# EAGLE design GDEnvSensorGW_1_13 (EAGLE 8.2.1)
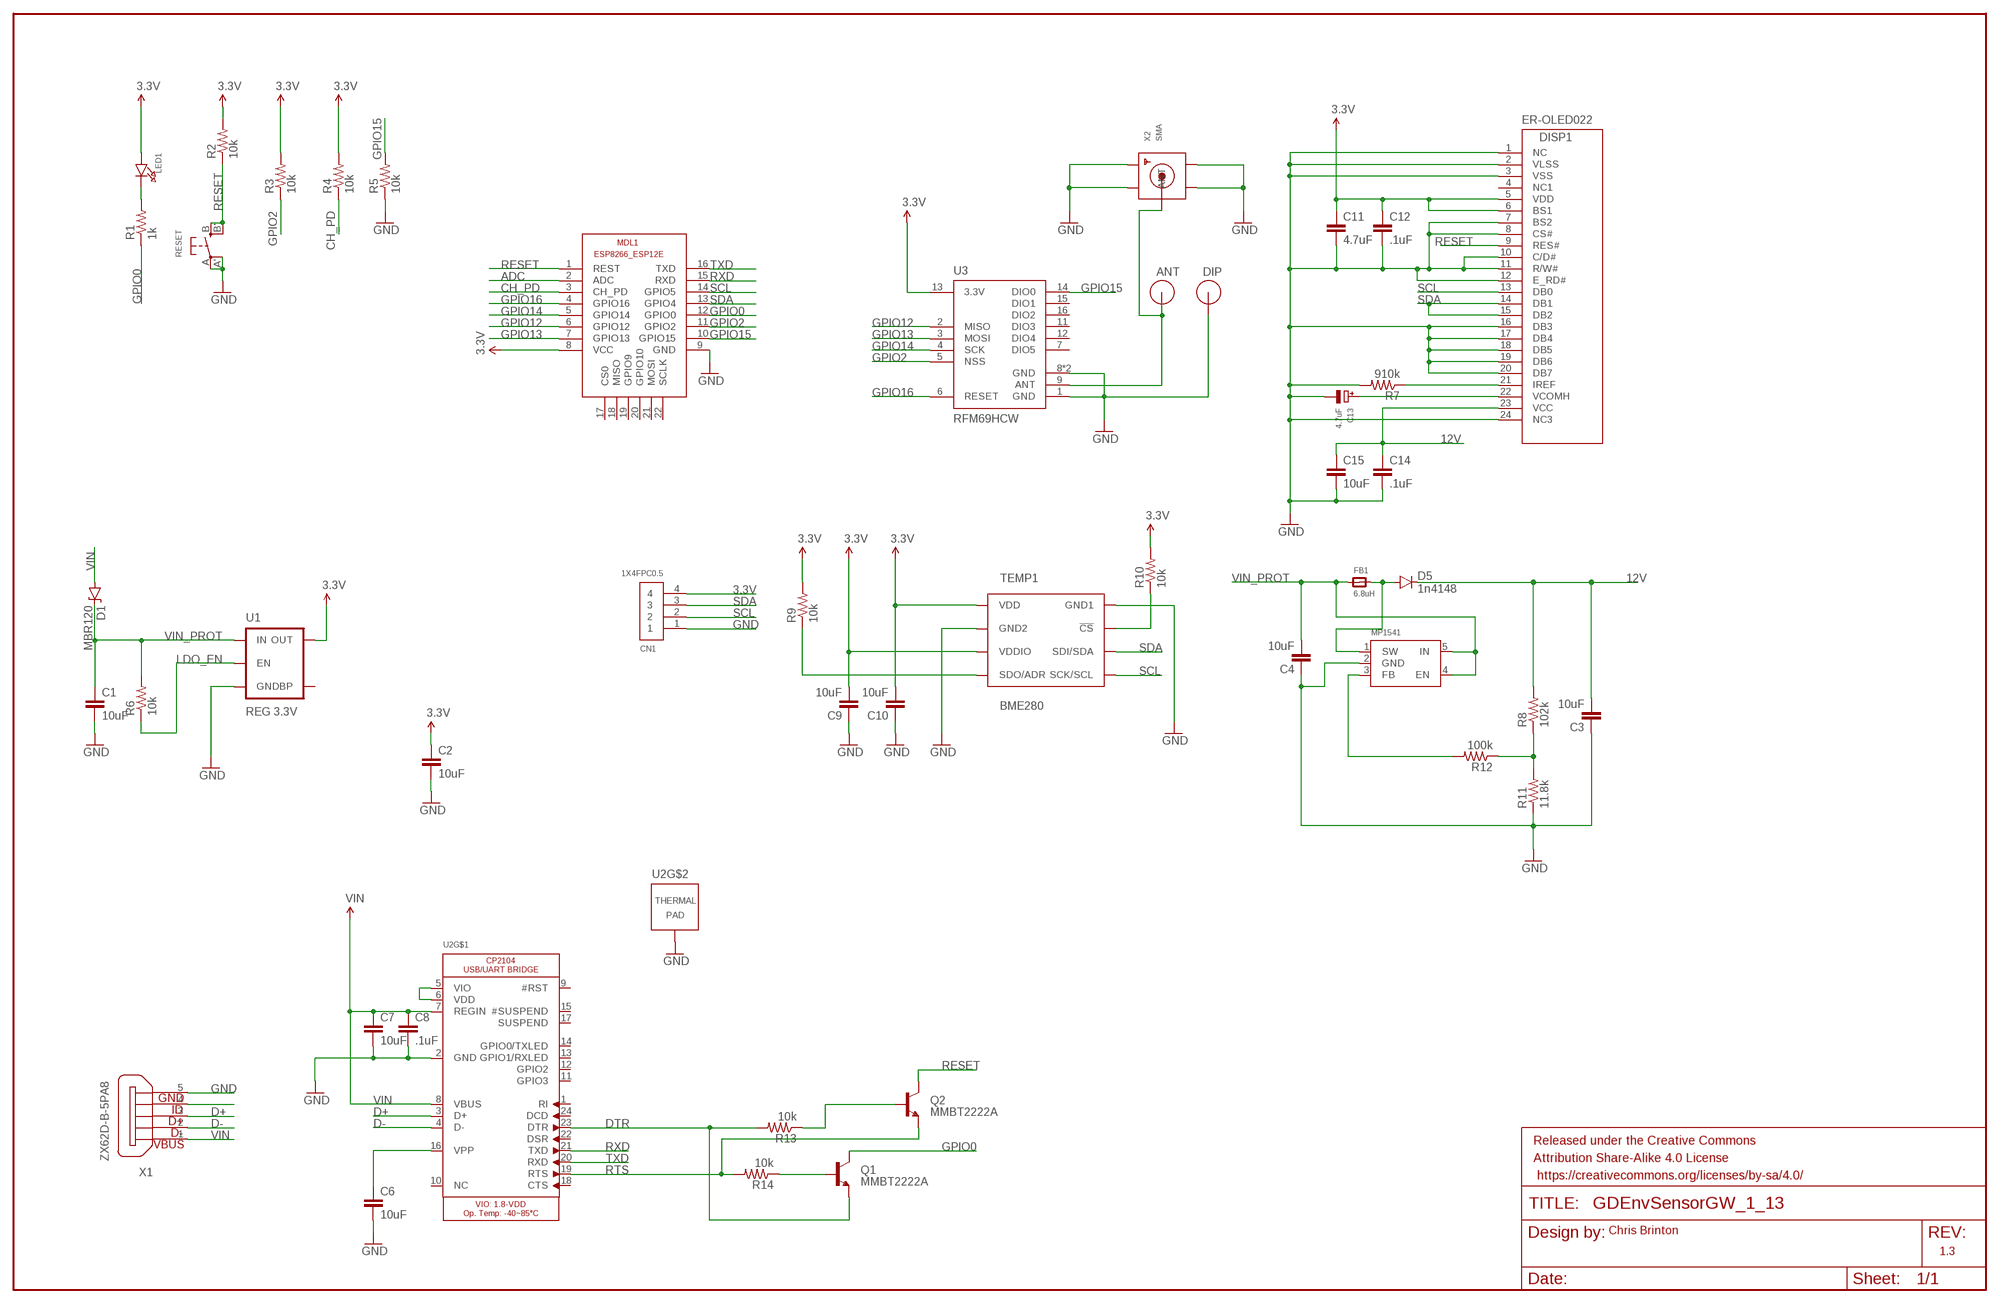
[diagram p0: schematic, sheet 1]

## Parts
ANT  RFM12B_ANTENNA  [RFM12B-ANTENNA]
ANT1  RFM12B_ANTENNA  [RFM12B-ANTENNA]
C1  10uF  10UF10V10%(0805)  [0805-CAP]
C2  10uF  10UF10V10%(0805)  [0805-CAP]
C3  10uF  10UF10V10%(0805)  [0805-CAP]
C4  10uF  10UF10V10%(0805)  [0805-CAP]
C6  10uF  10UF10V10%(0805)  [0805-CAP]
C7  10uF  10UF10V10%(0805)  [0805-CAP]
C8  .1uF  10UF10V10%(0805)  [0805-CAP]
C9  10uF  10UF10V10%(0805)  [0805-CAP]
C10  10uF  10UF10V10%(0805)  [0805-CAP]
C11  4.7uF  10UF10V10%(0805)  [0805-CAP]
C12  .1uF  10UF10V10%(0805)  [0805-CAP]
C13  4.7uF  CAP_TANTALUMA/3216_REFLOW  [EIA3216-18/A-R]
C14  .1uF  10UF10V10%(0805)  [0805-CAP]
C15  10uF  10UF10V10%(0805)  [0805-CAP]
CN1  1X4FPC0.5  [FPC_0.5MM-4]
D1  MBR120  DIODE-ZENER16V  [SOD-123]
D5  1n4148  DIODEBAS16  [SOD-323]
DISP1  ER-OLED022  [ER-OLED022]
FB1  6.8uH  FERRITE_0805  [_0805]
FRAME1  FRAME-LEDGER  [CREATIVE_COMMONS]
LED1  LED0805  [CHIPLED_0805]
MDL1  ESP8266-ESP12F  ESP8266-12EESP8266-ESP12E  [ESP8266-ESP12E]
MP1541  MP1541_SOT23-5  [SOT23-5]
Q1  MMBT2222A  TRANSISTOR_NPNMMBT2222A  [SOT23-3]
Q2  MMBT2222A  TRANSISTOR_NPNMMBT2222A  [SOT23-3]
R1  1k  R-US_R0805  [R0805]
R2  10k  R-US_R0805  [R0805]
R3  10k  R-US_R0805  [R0805]
R4  10k  R-US_R0805  [R0805]
R5  10k  R-US_R0805  [R0805]
R6  10k  R-US_R0805  [R0805]
R7  910k  R-US_R0805  [R0805]
R8  102k  R-US_R0805  [R0805]
R9  10k  R-US_R0805  [R0805]
R10  10k  R-US_R0805  [R0805]
R11  11.8k  R-US_R0805  [R0805]
R12  100k  R-US_R0805  [R0805]
R13  10k  R-US_R0805  [R0805]
R14  10k  R-US_R0805  [R0805]
RESET  SWITCH_TACT_SMT4.6X2.8  [BTN_KMR2_4.6X2.8]
TEMP1  BME280  [BME280_LGA]
U1  REG 3.3V  V_REG_MIC52193.3V  [SOT23-5]
U2  CP2104  [QFN24_4MM_SMSC]
U3  RFM69HCW  [RFM69HCW-XXXS2]
X1  ZX62D-B-5PA8  [ZX62D-B-5PA8]
X2  SMA  SMACONNECTOR_EDGE_UFL  [SMA_EDGELAUNCH_UFL]

## Nets
3.3V: C2.1 C9.2 C10.2 C11.1 C12.1 CN1.4 DISP1.5(VDD) DISP1.6(BS1) LED1.A MDL1.8(VCC) R2.2 R3.2 R4.2 R9.2 R10.2 TEMP1.P$6(VDDIO) TEMP1.P$8(VDD) U1.5(OUT) U3.13(3.3V)
12V: C3.2 C14.1 C15.1 D5.C DISP1.23(VCC) R8.2
ADC: MDL1.2(ADC)
ANT: ANT.P$1 U3.9(ANT) X2.P(ANT)
CH_PD: MDL1.3(CH_PD) R4.1
D+: U2.3(D+) X1.3
D-: U2.4(D-) X1.2
DTR: Q1.2(E) R13.2 U2.23(DTR)
GND: ANT1.P$1 C1.2 C2.2 C3.1 C4.1 C6.2 C7.2 C8.2 C9.1 C10.1 C11.2 C12.2 C13.- C14.2 C15.2 CN1.1 DISP1.1(NC) DISP1.2(VLSS) DISP1.3(VSS) DISP1.7(BS2) DISP1.8(CS#) DISP1.10(C/D#) DISP1.11(R/W#) DISP1.12(E_RD#) DISP1.16(DB3) DISP1.17(DB4) DISP1.18(DB5) DISP1.19(DB6) DISP1.20(DB7) DISP1.24(NC3) MDL1.9(GND) MP1541.2(GND) R5.1 R7.2 R11.1 RESET.A'(P1) RESET.A(P) TEMP1.P$1(GND1) TEMP1.P$7(GND2) U1.2(GND) U2.2(GND) U2.THERM(TP) U3.1(GND) U3.8(GND) U3.10(GND) X1.5 X2.GND@1(GND1) X2.GND@2(GND2) X2.GND@3(GND3) X2.GND@4(GND4)
GPIO0: MDL1.12(GPIO0) Q1.3(C) R1.1
GPIO2: MDL1.11(GPIO2) R3.1 U3.5(NSS)
GPIO12: MDL1.6(GPIO12) U3.2(MISO)
GPIO13: MDL1.7(GPIO13) U3.3(MOSI)
GPIO14: MDL1.5(GPIO14) U3.4(SCK)
GPIO15: MDL1.10(GPIO15) R5.2 U3.14(DIO0)
GPIO16: MDL1.4(GPIO16) U3.6(RESET)
LDO_EN: R6.1 U1.3(EN)
N$1: U2.5(VIO) U2.6(VDD)
N$3: LED1.C R1.2
N$4: C13.+ DISP1.22(VCOMH)
N$5: C6.1 U2.16(VPP)
N$6: R10.1 TEMP1.P$2(!CS)
N$8: D5.A FB1.2 MP1541.1(SW)
N$9: Q2.1(B) R13.1
N$10: R8.1 R11.2 R12.1
N$11: DISP1.21(IREF) R7.1
N$15: MP1541.3(FB) R12.2
N$16: X1.4
N$17: Q1.1(B) R14.1
RESET: DISP1.9(RES#) MDL1.1(REST) Q2.3(C) R2.1 RESET.B'(S1) RESET.B(S)
RTS: Q2.2(E) R14.2 U2.19(RTS)
RXD: MDL1.15(RXD) U2.21(TXD)
SCL: CN1.2 DISP1.13(DB0) MDL1.14(GPIO5) TEMP1.P$4(SCK/SCL)
SDA: CN1.3 DISP1.14(DB1) DISP1.15(DB2) MDL1.13(GPIO4) TEMP1.P$3(SDI/SDA)
SDO: R9.1 TEMP1.P$5(SDO/ADR)
TXD: MDL1.16(TXD) U2.20(RXD)
VIN: C7.1 C8.1 D1.A U2.7(REGIN) U2.8(VBUS) X1.1
VIN_PROT: C1.1 C4.2 D1.C FB1.1 MP1541.4(EN) MP1541.5(IN) R6.2 U1.1(IN)
Unconnected: DISP1.4(NC1) MDL1.17(CS0) MDL1.18(MISO) MDL1.19(GPIO9) MDL1.20(GPIO10) MDL1.21(MOSI) MDL1.22(SCLK) U1.4(BP) U2.1(RI) U2.9(#RST) U2.10(NC) U2.11(GPIO3) U2.12(GPIO2) U2.13(GPIO1/RXLED) U2.14(GPIO0/TXLED) U2.15(#SUSPEND) U2.17(SUSPEND) U2.18(CTS) U2.22(DSR) U2.24(DCD) U3.7(DIO5) U3.11(DIO3) U3.12(DIO4) U3.15(DIO1) U3.16(DIO2) X1.S1 X1.S2 X1.S3 X1.S4

## Notes on the sheet
- Chris Brinton
- 1.3

## Library data of the parts
ANT = LowPowerLab:RFM12B_ANTENNA; LABEL: ANT
ANT1 = LowPowerLab:RFM12B_ANTENNA; LABEL: DIP
C1-C4 C6-C12 C14 C15 = SparkFun-Capacitors:10UF10V10%(0805): CAP-11330; PROD_ID: CAP-11330
C13 = microbuilder:CAP_TANTALUM: Tantalum Capacitors Wave footprints have larger pads and are meant to be used for hand soldering. Reflow footprints are optimised for solder paste and a reflow oven. EIA3216-18/A-[R/W] - Size A / 3216-18 / 1206 footprint 4.7µF 25V 10% Tantalum Capacitor 10µF 16V 10% Tantalum Capacitor [Digikey: 495-2236-2-ND] EIA3528-21/B-[R/W] - Size B / 3528-21 47µF 10V 10% Tantalum Capactior [Digikey: 495-2216-1-ND] EIA6032-28/C-[R/W] - Size C / 6032-28 10µF 35V 20% Tantalum Capacitor [Digikey: 495-2285-1-ND] 100µF 16V 10% Tantalum Capactior [Digikey: 399-5214-1-ND]
CN1 = adafruit:1X4: 4-pin connector
D1 = SparkFun-DiscreteSemi:DIODE-ZENER: Zener Diode Production Part - 8199 3.4V Zener Voltage; PROD_ID: DIO-12440; VALUE: 16V
D5 = SparkFun-DiscreteSemi:DIODE: Diode These are standard reverse protection diodes and small signal diodes. SMA package can handle up to about 1A. SOD-323 can handle about 200mA. What the SOD-323 package when ordering, there are some mfgs out there that are 5-pin packages.; PROD_ID: DIO-09646; VALUE: 250mA/100V
DISP1 = GDTech:ER-OLED022: East Rising 2.2" OLED display 128x32 24 pin .5mm pitch FPC connector
FB1 = microbuilder:FERRITE: Ferrite Bead 0603 MMZ1608B121C - 120 Ohm @ 100MHz, 600mA, 0.15 Ohm DC Resistance - Digikey: 445-2164-1-ND BK1608HW121-T - 120 Ohm, 600mA Ferrite Chip - Digikey: 587-1876-2-ND 0805 HZ0805B272R-10 - 2.7K Ohm @ 100MHz, 200mA, 0.8 Ohm DC Resistance - Digikey: 240-2504-1-ND (see also Murata BLM21BD272SN1L) MMZ2012Y152B - 1.5K Ohm @ 100MHz, 500mA, 0.4 Ohm DC Resistance - Digikey: 445-1560-1-ND - Mainly for high frequency (80-400MHz) MMZ2012R102A - 1K Ohm @ 100MHz, 500mA, 0.3 Ohm DC Resistance - Digikey: 445-1555-2-ND - More general purpose (10-200MHz)
FRAME1 = SparkFun-Aesthetics:FRAME-LEDGER: Schematic Frame Standard 11x14 US Ledger frame
LED1 = microbuilder:LED: LED 0603 - 0603 Surface Mount Package 2mA: Green LED - Low Power (3.9mcd, 2ma, 1.7Vf) - Digikey: 475-2709-2-ND Orange LED - Low Power (9.8mcd, 2ma, 1.8Vf) - Digikey: 475-1194-2-ND Red LED - Low Power (5mcd, 2ma, 1.8Vf) - Digikey: 475-1195-2-ND Yellow LED - Low Power (7mcd, 2ma, 1.8Vf) - Digikey: 475-1196-2-ND 5mA: Blue LED - Low Power (17mcd, 5ma, 2.9Vf) - Digikey: LNJ937W8CRACT-ND 0805 - 0805 Surface Mount Package 2mA: Red LED (8.8mcd, 2mA, 1.8Vf, Clear) - Low Power [Digikey: 475-2510-1-ND] Green LED (5mcd, 2mA, 1.8Vf, Clear) - Low Power [Digikey: 475-2730-1-ND] Yellow LED (11.3mcd, 2mA, 1.8Vf, Clear) - Low Power [Digikey: 475-2555-1-ND] 20mA: Red LED (104mcd, 20mA, Diffused) - LS R976 [Digikey: 475-1278-6-ND] Red LED (12mcd, 20mA, 2.0Vf, Clear) - APT2012EC [Digikey: 754-1128-1-ND] Green LED (15mcd, 20mA, 2.2Vf, Clear) - APT2012GC [Digikey: 754-1131-1-ND] Orange LED (160mcd, 20mA, 2.1Vf, Clear) - APT2012SECK [Digikey: 754-1130-1-ND] 1206 - 1206 Surface Mount Package Green LED (26mcd, 20mA, Diffused) - LG N971 [Digikey: 475-1407-6-ND] Red LED (15mcd, 20mA, Diffused) - LH N974 [Digikey: 475-1416-6-ND]
MDL1 = ESP12E:ESP8266-12E: ESP8266-12E with additional I/O and GPIO04/05 corrected The author cannot warrant that this library is free from error or will meet your specific requirements. Created by PuceBaboon.com. Komagane, Nagano, JAPAN
MP1541 = GDTech:MP1541_SOT23-5: SOT23-5 MP1541 Voltage Boost The MP1541 is a 5-pin thin SOT23 current mode step up converter intended for small, low power applications
Q1 Q2 = SparkFun-DiscreteSemi:TRANSISTOR_NPN: Generic NPN BJT MMBT2222A - TRANS-08049 (SOT-23, 1A 40V) MPSA42 - TRANS-09116 (SOT-23, 500mA 300V) MMBT5088LT1G - TRANS-11160 (SOT-23, 50 mA 30V) BC547 - COM-08928 <http://www.sparkfun.com/products/8928> (TO-92 45V 100mA) (1.Collector 2.Base 3.Emitter) 2N3904 - COM-00521 <http://www.sparkfun.com/products/521> (TO-92 40V 200mA) (1.Emitter 2.Base 3.Collector) P2N2222A - COM-12852 <http://www.sparkfun.com/products/12852> (TO-92 40V 600mA) (1.Collector 2.Base 3.Emitter); PROD_ID: TRANS-08049
R1-R14 = adafruit:R-US_: RESISTOR, American symbol
RESET = microbuilder:SWITCH_TACT_SMT: SMT Tact Switches 6x6mm - Digikey: P12940SCT-ND KMR2 (4.6x2.8mm) - Digikey: 401-1426-1-ND EVQ-PQHB55 - Light Touch, 160GF (4.5x4.5mm) - Digikey: P8090SCT-ND
TEMP1 = BME280ComponentLibrary:BME280; PROD_ID: IC-13090
U1 = SparkFun-PowerIC:V_REG_MIC5219: V_REG MIC5219 Standard 3.3V and 5V 500mA LDO voltage regulator in SOT-23 layout. Micrel part MIC5219. BP (by-pass) pin is used to lower output noise with 470pF cap, may be left open.; PROD_ID: VREG-09872; VALUE: MIC5219 3.3V
U2 = GDTech:CP2104: CP2104 - USB to UART Bridge VDD Output: 3.45V
U3 = SparkFun-RF:RFM69H; PROD_ID: IC-11997, IC-12053
X1 = GDTech:ZX62D-B-5PA8: Micro USB Type B Connector - Standard, Shell Through Hole Source: http://www.hirose.co.jp/cataloge_hp/ed_ZX_20140804.pdf; MF: Hirose; MPN: ZX62D-B-5PA8; OC_FARNELL: 2300438; OC_NEWARK: 69W0712
X2 = adafruit:SMACONNECTOR: SMA Connector 90° DIP SMA Connector, 50 Ohm (4UConnector: 07259)

## Board
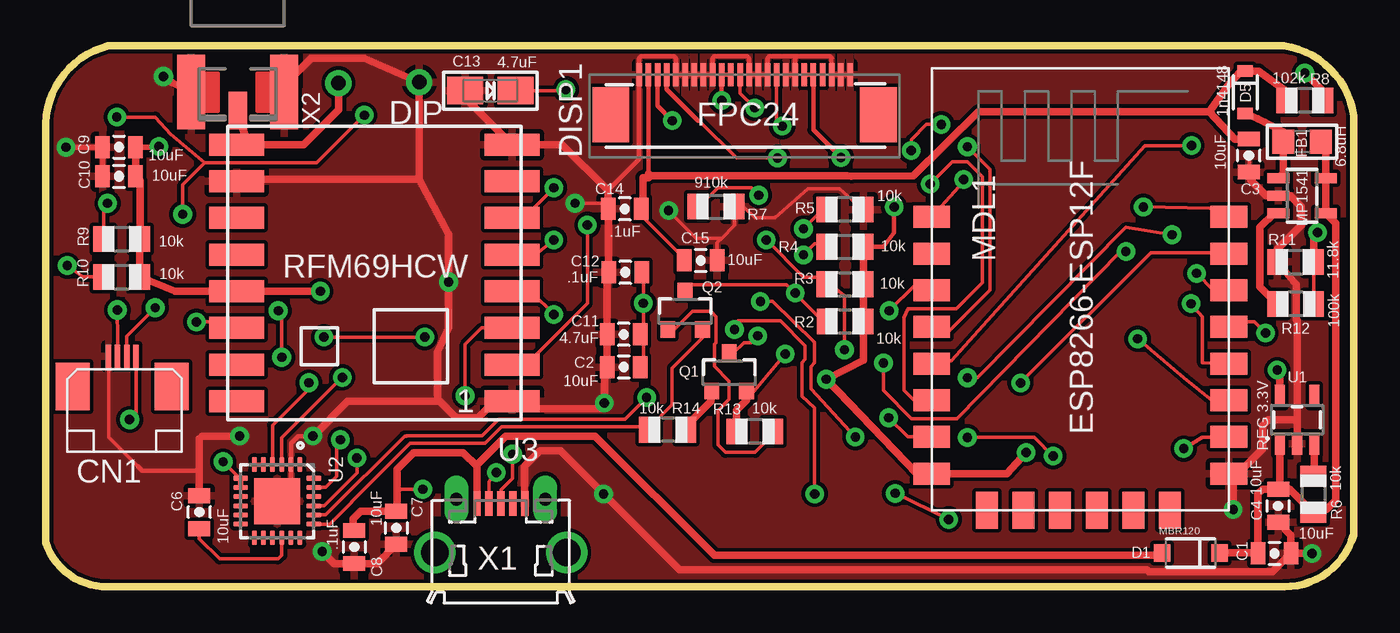
[diagram p1: board, top side]
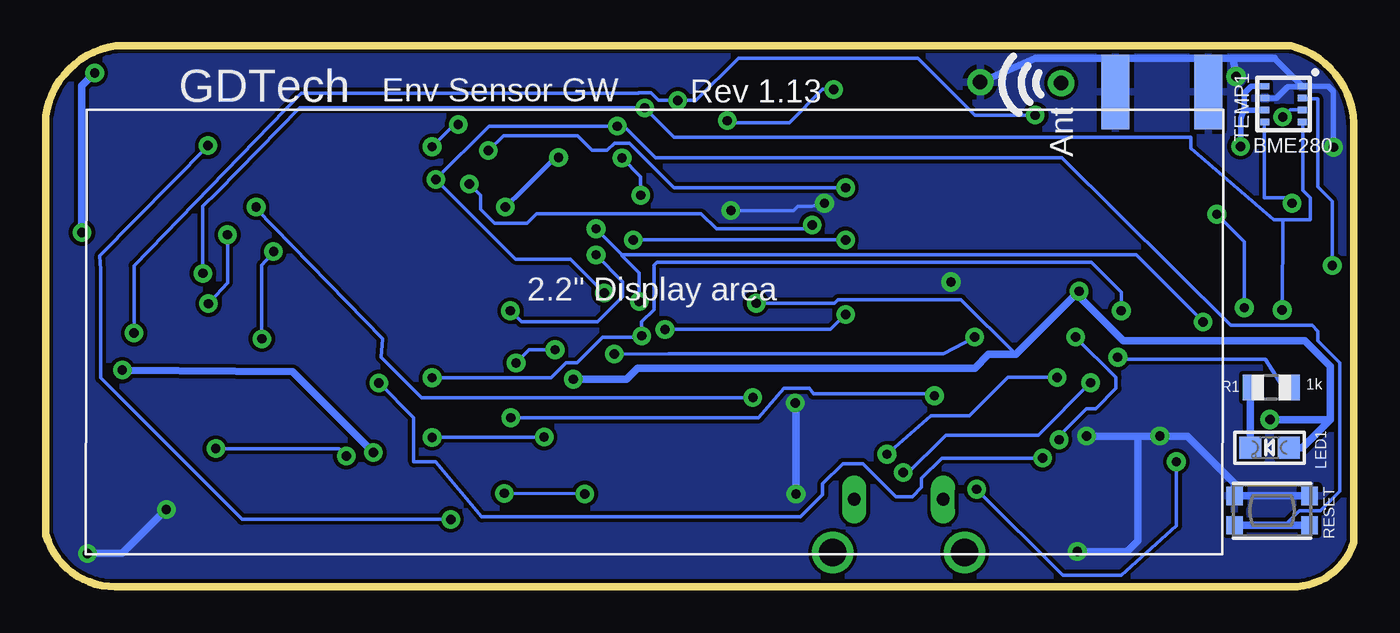
[diagram p2: board, bottom side, seen from below]

Size 71.34 x 29.49 mm. Coordinates in mm from the lower left corner, seen from the top.
Outline: 0,25.28 arc-74 3.41,29.49 67.53,29.49 arc-74 71.34,25.68 71.34,2.82 arc-74 67.56,0 3.39,0 arc-74 0,2.42 0,25.28
Copper layers (1*16): Top 0.035mm / dielectric 1.5mm / Bottom 0.035mm
Design rules "SparkFun": minimum track width 8mil, minimum drill 20mil, track to track 8mil, track to pad 8mil, pad to pad 8mil, via to via 8mil, smd to smd 8mil, copper to edge 8mil, drill to drill 8mil, minimum pad ring 12mil, minimum via ring 10mil, stop-mask expansion 4mil, vias tented up to drill 20mil, thermal gap 10mil

### Footprints (pad centres in the part's own frame; a part is rotated, then mirrored left to right if it is on the bottom)
RFM12B-ANTENNA = drill 0.8 pad 1.422: P$1 0,0
0805-CAP = smd 0.8 x 1.2: 1 -0.9,0; 2 0.9,0
EIA3216-18/A-R = smd 1.95 x 1.5: + 1.375,0; - -1.375,0
FPC_0.5MM-4 = smd 0.3 x 1.25: 1 -0.75,-0.45; 2 -0.25,-0.45; 3 0.25,-0.45; 4 0.75,-0.45 | smd 1.85 x 2.6: MT -2.7,-2.1; MT2 2.7,-2.1
SOD-123 = smd 0.9 x 0.95: A 1.575,0; C -1.575,0
SOD-323 = smd 0.63 x 0.83: A 1.15,0; C -1.15,0
ER-OLED022 = smd 0.3 x 1.25: 1 5.75,12.905; 2 5.25,12.905; 3 4.75,12.905; 4 4.25,12.905; 5 3.75,12.905; 6 3.25,12.905; 7 2.75,12.905; 8 2.25,12.905; 9 1.75,12.905; 10 1.25,12.905; 11 0.75,12.905; 12 0.25,12.905; 13 -0.25,12.905; 14 -0.75,12.905; 15 -1.25,12.905; 16 -1.75,12.905; 17 -2.25,12.905; 18 -2.75,12.905; 19 -3.25,12.905; 20 -3.75,12.905; 21 -4.25,12.905; 22 -4.75,12.905; 23 -5.25,12.905; 24 -5.75,12.905 | smd 2 x 3: MOUNT1 -7.3,10.705; MOUNT2 7.3,10.705
_0805 = smd 1.2 x 1.3: 1 -1.016,0; 2 1.016,0
CHIPLED_0805 = smd 1.2 x 1.2: A 0,-1.05; C 0,1.05
ESP8266-ESP12E = smd 2 x 1.2: 1 0,16; 2 0,14; 3 0,12; 4 0,10; 5 0,8; 6 0,6; 7 0,4; 8 0,2; 9 16.2,2; 10 16.2,4; 11 16.2,6; 12 16.2,8; 13 16.2,10; 14 16.2,12; 15 16.2,14; 16 16.2,16 | smd 1.2 x 2: 17 11,0; 18 3,0; 19 5,0; 20 13,0; 21 7,0; 22 9,0
SOT23-5 = smd 0.55 x 1.2: 1 -0.95,-1.3; 2 0,-1.3; 3 0.95,-1.3; 4 0.95,1.3; 5 -0.95,1.3
SOT23-3 = smd 0.8 x 0.9: 1 -0.95,-1; 2 0.95,-1; 3 0,1.1
R0805 = smd 1.1 x 1.4: 1 -1,0; 2 1,0
BTN_KMR2_4.6X2.8 = smd 0.9 x 1: A 2.05,0.8; A' -2.05,0.8; B 2.05,-0.8; B' -2.05,-0.8
BME280_LGA = smd 0.5 x 0.35: P$1 1.025,0.975; P$2 1.025,0.325; P$3 1.025,-0.325; P$4 1.025,-0.975; P$5 -1.025,-0.975; P$6 -1.025,-0.325; P$7 -1.025,0.325; P$8 -1.025,0.975
QFN24_4MM_SMSC = smd 0.8 x 0.28: 1 -2,1.25; 2 -2,0.75; 3 -2,0.25; 4 -2,-0.25; 5 -2,-0.75; 6 -2,-1.25; 13 2,-1.25; 14 2,-0.75; 15 2,-0.25; 16 2,0.25; 17 2,0.75; 18 2,1.25 | smd 0.28 x 0.8: 7 -1.25,-2; 8 -0.75,-2; 9 -0.25,-2; 10 0.25,-2; 11 0.75,-2; 12 1.25,-2; 19 1.25,2; 20 0.75,2; 21 0.25,2; 22 -0.25,2; 23 -0.75,2; 24 -1.25,2 | smd 2.5 x 2.5: THERM 0,0
RFM69HCW-XXXS2 = smd 3 x 1.2: 1 -7.5,7; 2 -7.5,5; 3 -7.5,3; 4 -7.5,1; 5 -7.5,-1; 6 -7.5,-3; 7 -7.5,-5; 8 -7.5,-7; 9 7.5,-7; 10 7.5,-5; 11 7.5,-3; 12 7.5,-1; 13 7.5,1; 14 7.5,3; 15 7.5,5; 16 7.5,7
ZX62D-B-5PA8 = smd 1.35 x 0.4: 1 4.825,1.3; 2 4.825,0.65; 3 4.825,0; 4 4.825,-0.65; 5 4.825,-1.3 | drill 1.5: S1 2.15,-3.6; S2 2.15,3.6 | drill 0.7 long: S3 5.05,2.425; S4 5.05,-2.425
SMA_EDGELAUNCH_UFL = smd 4.064 x 1.524: GND@1 2.032,-2.54; GND@2 2.032,2.54 | smd 4.064 x 1.524 bottom: GND@3 2.032,2.54; GND@4 2.032,-2.54 | smd 2.032 x 1.016: P 3.048,0

### Placement (x,y rotation side)
ANT  15.96,27.46 0 top
ANT1  20.37,27.51 0 top
C1  67.02,1.81 0 top
C2  31.52,11.98 180 top
C3  65.62,23.51 90 top
C4  67.22,4.41 90 top
C6  8.37,4.06 90 top
C7  19.12,3.21 270 top
C8  16.82,2.16 270 top
C9  4,23.97 0 top
C10  3.99,22.38 0 top
C11  31.52,13.75 180 top
C12  31.6,17.14 180 top
C13  24.25,27.05 0 top
C14  31.58,20.6 180 top
C15  35.72,17.79 0 top
CN1  4.17,13.01 0 top
D1  62.45,1.84 180 top
D5  65.42,26.96 270 top
DISP1  38.12,15.02 0 top
FB1  68.52,24.26 180 top
FRAME1  6.43,-12.11 0 top  (outside the outline)
LED1  4.59,7.58 90 bottom
MDL1  48.32,4.16 0 top
MP1541  68.52,21.31 270 top
Q1  37.27,11.66 0 top
Q2  34.87,15.01 0 top
R1  4.5,10.87 180 bottom
R2  43.6,14.47 0 top
R3  43.59,16.49 0 top
R4  43.59,18.54 0 top
R5  43.59,20.57 180 top
R6  69.14,5.04 270 top
R7  36.56,20.72 0 top
R8  68.67,26.51 180 top
R9  4.14,18.97 0 top
R10  4.13,16.89 0 top
R11  68.17,17.71 0 top
R12  68.17,15.41 180 top
R13  38.67,8.46 180 top
R14  33.92,8.56 180 top
RESET  4.45,4.15 0 bottom
TEMP1  3.83,26.32 0 bottom
U1  68.25,9.1 0 top
U2  12.62,4.66 270 top
U3  17.92,17.11 180 top
X1  24.82,-0.29 90 top
X2  10.47,29.01 270 top

### Tracks (layer width: path | path; a pad name or v marks a point on that pad's centre or on a via)
3.3V  (via drill 0.51, 0.51 pad 1.02, 0.51 pad 1.05)
  Top 0.203: C2.1 32.59,12 32.59,13.63 C11.1 32.59,13.83 v32.59,15.46 32.59,17.08 C12.1 | CN1.4 4.92,9.46 v4.57,9.11
  Top 0.254: DISP1.6 DISP1.5 41.87,24.92 v43.37,23.41 | R4.2 45.69,18.54 46.27,19.31 v46.27,20.71
  Top 0.305: C9.2 5.83,23.97 v6.17,24.01
  Top 0.406: U1.5 67.3,11.58 v67.17,11.81 | v53.47,7.31 52.42,6.16 MDL1.8 47.52,6.16 v42.57,11.31 44.6,12.34 R2.2 44.6,16.69 R3.2 R4.2 44.59,18.73 | v14.97,16.11 U3.13 7.05,16.11 R10.2 5.13,18.56 R9.2 5.14,22.13 C10.2 C9.2
  Bottom 0.203: v32.59,15.46 28.32,15.46 28.12,15.66 21.42,15.66 18.42,12.66 18.37,12.61
  Bottom 0.254: v43.37,23.41 43.53,23.42 45.33,21.62 v46.27,20.71
  Bottom 0.305: 5.99,25.99 TEMP1.P$6 | 5.99,25.99 6.17,25.51 v6.17,24.01 | TEMP1.P$8 5.59,27.29 5.97,26.91 5.97,26.01 5.99,25.99
  Bottom 0.406: v67.17,11.81 57.87,11.71 v53.47,7.31 | 15.12,15.96 18.42,12.66 19.92,12.66 20.67,11.91 39.07,11.91 39.67,11.31 v42.57,11.31 | 15.12,15.96 v14.97,16.11 | LED1.A 2.8,7.58 1.27,9.11 | 1.27,9.11 1.27,12.01 2.67,13.41 12.57,13.41 15.12,15.96 | 1.27,9.11 v4.57,9.11
12V
  Top 0.203: C15.1 34.62,17.89 34.62,18.1 32.59,20.13 32.59,20.54 C14.1
  Top 0.254: DISP1.23 32.87,22.51
  Top 0.305: 32.87,22.51 32.87,22.32 32.87,22.31
  Top 0.406: R8.2 67.67,27.01 66.17,28.11 D5.C 65.17,28.11 64.57,27.41 63.47,25.91 | C3.2 64.87,24.41 63.47,25.91 | 63.47,25.91 50.87,25.91 47.33,22.41 43.95,22.39 43.69,22.42 32.96,22.42 32.87,22.51 | 32.87,22.31 32.57,22.31 32.57,20.69 C14.1
ANT
  Top 0.406: X2.P 10.87,24.56 U3.9 14.07,24.11 15.96,26 ANT.P$1
CH_PD  (via drill 0.51)
  Top 0.203: v41.33,18.1 41.94,18.71 42.55,18.71 R4.1 | v46,15.05 47.42,16.47 48.44,16.47 MDL1.3
  Bottom 0.203: v46,15.05 45.39,14.44 41.24,14.44 39.87,15.81 39.87,16.64 v41.33,18.1
D+  (via drill 0.51 pad 1.02)
  Top 0.203: U2.3 12.87,8.11 v16.17,11.41 | v25.46,7.22 25.46,5.91 24.84,5.29 24.84,4.56 X1.3
  Bottom 0.203: v16.17,11.41 18.87,11.41 20.97,9.31 23.07,9.31 v25.46,7.22
D-  (via drill 0.51 pad 1.02)
  Top 0.203: U2.4 12.37,8.81 14.35,10.79 v14.35,11.12 | X1.2 24.17,5.73 v24.57,6.23
  Bottom 0.203: v24.57,6.23 24.47,6.05 22.25,8.27 17.2,8.27 v14.35,11.12
DTR  (via drill 0.51 pad 1.02)
  Top 0.203: U2.23 15.27,5.41 15.87,6.01 15.87,7.81 v16.07,8.01 | Q1.2 38.62,10.66 v40.33,12.68 | v20.67,13.61 v15.17,13.61
  Top 0.406: Q1.2 38.22,10.16 37.67,9.61 R13.2
  Bottom 0.203: v16.07,8.01 16.07,8.21 14.57,9.71 14.07,9.71 12.97,10.81 12.97,11.41 v15.17,13.61 | v40.33,12.68 37.37,12.71 22.37,12.71 v20.67,13.61
GND  (via drill 0.51 pad 1.02, 0.51 pad 1.05)
  Top 0.203: R5.1 43.28,21.71 41.57,21.71 39.77,20.11 38.67,20.11 38.06,20.72 R7.2 37.57,20.71 37.57,19.71 36.87,19.01 | C15.2 36.62,18.76 36.87,19.01 | 36.87,19.01 35.47,19.01 v33.97,20.51 | v28.87,20.91 30.67,20.91 | DISP1.18 DISP1.19 | 21.97,16.81 v21.97,16.61 | C3.1 65.67,23.51 | CN1.1 3.42,8.16 5.02,6.56
  Top 0.254: v14.57,8.21 13.77,8.21 13.37,7.81 U2.2 13.37,5.41 U2.THERM | DISP1.8 DISP1.7 40.87,28.81 40.97,28.91 | DISP1.2 DISP1.1 DISP1.3 42.87,28.81 42.77,28.91 40.97,28.91 | 40.97,28.91 39.47,28.91 39.37,28.81 DISP1.10 DISP1.11 DISP1.12 38.37,28.82 38.27,28.91 36.47,28.91 36.37,28.81 DISP1.16 DISP1.17 DISP1.18 | 30.67,21.61 32.37,23.31 DISP1.24 32.37,28.81 32.47,28.91 34.27,28.91 34.37,28.82 DISP1.20 DISP1.19 | 5.02,6.56 5.27,6.31 8.17,6.31 8.37,6.51
  Top 0.305: v1.1,23.96 C9.1 C10.1
  Top 0.406: X1.5 26.12,6.56 26.97,7.41 28.07,7.41 v30.42,5.06 | 30.57,4.91 v30.42,5.06 | v30.42,5.06 34.57,0.91 60.07,0.91 60.17,0.81 65.54,0.81 65.55,0.81 66.91,0.81 C1.2 | C1.2 67.92,2.81 C4.1 | 68.25,9.11 U1.2 | 68.25,9.11 68.25,14.51 68.21,14.54 68.21,16.47 R11.1 67.17,18.41 68.47,19.71 68.47,20.71 67.87,21.31 MP1541.2 66.57,21.31 65.72,22.16 C3.1 | 64.97,6.56 MDL1.9 | 64.97,6.56 65.42,6.56 66.37,7.51 66.37,8.81 66.67,9.11 68.25,9.11 | C1.2 v69.07,1.81 | v64.77,4.21 64.77,6.36 64.97,6.56 | 21.47,10.11 16.47,10.11 v14.57,8.21 | v10.57,8.21 8.52,8.21 8.37,8.06 8.37,6.51 C6.2 | 16.77,1.31 C8.2 | C8.2 18.07,1.26 C7.2 | U3.10 11.27,22.11 11.37,22.21 20.37,22.21 | 21.47,10.11 21.37,10.21 21.37,12.81 21.97,14.11 v21.97,16.61 | C13.- 22.88,26.66 U3.8 28.17,24.11 30.67,21.61 30.67,20.91 C14.2 30.7,20.58 C12.2 30.62,17.07 C11.2 C2.2 30.47,11.83 v30.47,10.01 30.27,9.71 25.82,9.71 U3.1 24.47,10.11 23.57,9.21 22.37,9.21 21.47,10.11 | 21.97,16.81 21.97,19.21 20.37,22.21 | C8.2 15.72,1.26 v15.07,1.91 | 20.37,22.21 ANT1.P$1 17.37,28.81 14.47,28.81 13.41,27.75 X2.GND@2 | X2.GND@1 6.9,27.48 v6.41,27.82
  Bottom 0.203: v33.97,20.51 30.55,20.51 30.32,20.74 29.54,20.74 v28.87,20.91
  Bottom 0.305: TEMP1.P$7 4.23,26.64 3.6,27.27 2.82,27.27 TEMP1.P$1 | TEMP1.P$1 1.38,27.29 1.11,27.02 v1.1,23.96 | 4.33,28.81 TEMP1.P$1
  Bottom 0.406: v30.42,5.06 30.42,9.66 v30.47,10.01 | v69.07,1.81 67.17,1.81 v64.77,4.21 | 11.77,8.21 v10.57,8.21 9.07,8.21 6.5,5.64 RESET.A' RESET.A | 11.77,8.21 v14.57,8.21 | v15.07,1.91 12.37,1.91 11.77,2.51 11.77,8.21 | ANT1.P$1 17.37,28.81 13.27,28.81 | 8.27,28.81 13.27,28.81 | 8.27,28.81 6.67,28.81 | 6.67,28.81 4.33,28.81 | v6.41,27.82 6.57,28.71 6.67,28.81 | X2.GND@2 13.41,28.67 13.27,28.81 | X2.GND@1 8.33,28.75 8.27,28.81
  pour Top: 3.57,29.61 67.27,29.61 arc-90 71.37,25.51 71.37,3.51 arc-90 67.77,-0.09 4.17,-0.09 arc-90 -0.03,4.11 -0.03,26.01 arc-90
  pour Bottom: 4.17,29.51 66.77,29.51 arc-90 71.47,24.81 71.47,3.51 arc-90 67.97,0.01 3.07,0.01 arc-90 0.07,3.01 0.07,25.41 arc-90
GPIO0  (via drill 0.51, 0.51 pad 1.02, 0.51 pad 1.05)
  Top 0.203: v50.27,11.39 50.81,11.39 58.91,19.59 v61.43,19.19 | v62.47,15.43 63.09,14.71 63.1,12.21 MDL1.12 | Q1.3 37.52,12.76 38.07,13.31 38.47,13.31 v38.84,13.68 | v12.87,12.51 12.87,14.86 v12.68,15.05
  Bottom 0.203: v12.68,15.05 12.68,16.07 14.3,17.69 34.83,17.69 34.84,17.68 38.01,17.68 38.16,17.53 38.16,15.22 38.17,15.22 38.17,15.11 38.84,14.44 v38.84,13.68 38.91,13.61 40.97,13.61 42.37,12.21 42.96,12.21 43.78,11.39 v50.27,11.39 | v61.43,19.19 61.43,16.57 62.37,15.54 v62.47,15.43 | R1.1 3.53,10.38 4.83,12.39 12.75,12.39 v12.87,12.51
GPIO2  (via drill 0.51)
  Top 0.203: v39.3,18.91 41.33,16.88 42.34,16.88 R3.1 42.55,16.67 43.56,15.86 v43.56,12.92 | v27.71,18.91 26.61,18.01 24.99,18.01 25.48,18.3 U3.5 | v59.56,13.52 62.08,11.39 63.78,10.04 64.03,10.09 64.4,10.19 MDL1.11 64.7,10.58 | v58.92,18.28 58.61,18.28 49.69,9.16 47.23,9.16 45.69,10.7 v45.69,12.2
  Bottom 0.203: v27.71,18.91 v39.3,18.91 | v59.56,13.52 59.56,17.54 v58.92,18.28 | v45.69,12.2 44.97,12.92 v43.56,12.92
GPIO12  (via drill 0.51)
  Top 0.203: v48.24,21.96 49.46,23.18 50.27,23.18 51.08,22.36 51.08,16.58 49.66,15.16 47.02,15.16 46.82,14.65 46.82,10.7 47.34,10.18 MDL1.6 | v29.54,19.72 29.54,15.46 26.29,12.2 25.48,12.2 U3.2
  Bottom 0.203: v48.24,21.96 47.63,21.35 47.63,20.57 46.87,19.81 45.1,19.81 44.58,20.33 35.59,20.33 34.77,19.51 29.75,19.51 v29.54,19.72
GPIO13  (via drill 0.51 pad 1.02)
  Top 0.203: MDL1.7 47.02,8.17 v45.97,9.21 | v22.87,10.41 22.87,13.21 23.77,14.11 U3.3
  Bottom 0.203: v45.97,9.21 32.47,9.21 31.07,10.81 30.92,10.81 30.81,10.83 29.68,10.83 29.47,10.51 22.97,10.51 v22.87,10.41
GPIO14  (via drill 0.51)
  Top 0.203: v62.49,24.06 59.95,24.06 49.41,12.31 48.44,12.31 MDL1.5 | v46.33,5.09 v49.25,3.67 | v41.94,5.06 41.94,9.77 41.25,10.38 41.25,12.2 41.42,12.4 41.42,13.15 40.06,14.51 37.74,14.51 v37.56,14.03 | v27.71,14.85 26.5,16.07 25.48,16.07 U3.4
  Bottom 0.203: v62.49,24.06 68.39,18.05 68.36,17.28 68.36,11.39 60.63,3.67 v49.25,3.67 | v46.33,5.09 46.21,5.09 v41.94,5.06 | v37.56,14.03 28.53,14.03 v27.71,14.85
GPIO15  (via drill 0.51)
  Top 0.203: v41.33,19.52 42.55,20.74 R5.2 | v8.21,14.44 10.04,14.44 10.24,14.24 U3.14 | v62.07,7.53 63.09,8.15 64.3,8.15 MDL1.10 | v54.94,7.12 53.93,8.14 v50.27,8.14 | v44.16,8.16 41.74,10.78 41.74,12 41.94,12.2 41.93,13.32 39.64,15.56 39.1,15.56 v38.98,15.56
  Bottom 0.203: v41.33,19.52 39.91,18.1 | v8.21,14.44 11.87,18.1 39.91,18.1 | v62.07,7.53 55.35,7.53 v54.94,7.12 | v50.27,8.14 44.38,8.14 v44.16,8.16 | 39.91,18.1 39.91,18.05 38.97,17.11 v38.97,15.57 v38.98,15.56
GPIO16  (via drill 0.51)
  Top 0.203: v50.27,23.99 51.49,22.77 51.49,16.18 49.25,13.94 48.64,14.64 MDL1.4 | v48.85,25.21 48.03,25.21 47.2,24.38 v47.2,23.78 | v27.71,21.75 26.09,20.13 25.48,20.13 U3.6
  Bottom 0.203: v50.27,23.99 49.25,25.01 49.05,25.01 v48.85,25.21 | v27.71,21.75 37.06,21.75 39.5,24.19 40.31,24.19 40.72,23.79 41.53,23.79 42.34,24.6 46.38,24.6 v47.2,23.78
LDO_EN
  Top 0.406: U1.3 69.2,6.1 R6.1
N$1
  Top 0.254: U2.6 U2.5
N$3
  Bottom 0.406: LED1.C 5.64,10.22 R1.2
N$4  (via drill 0.51 pad 1.02)
  Top 0.203: C13.+ 28.31,27.05 v28.37,27.11
  Top 0.254: DISP1.22 33.37,26.21 v34.17,25.41
  Bottom 0.203: v28.37,27.11 28.97,27.11 30.77,25.31 34.07,25.31 v34.17,25.41
N$5
  Top 0.203: U2.16 12.87,1.71 12.67,1.51 9.47,1.51 8.37,2.61 C6.1
N$6  (via drill 0.51 pad 1.02)
  Top 0.203: R10.1 2.01,16.91 v1.17,17.51
  Bottom 0.203: TEMP1.P$2 2.78,26.61 1.97,26.61 1.97,21.81 1.17,21.01 v1.17,17.51
N$8
  Top 0.406: MP1541.1 67.5,22.55 FB1.2 67.5,24.8 66.49,25.32 66.11,25.52 D5.A
N$9
  Top 0.203: R13.1 39.7,8.34 38.69,7.33 37.06,7.33 36.66,7.73 36.66,9.6 37.27,10.21 37.27,11.21 36.47,12.01 36.47,13.21 36.56,13.31 36.56,14.72 36.27,15.01 35.27,15.01 34.27,14.01 Q2.1
N$10  (via drill 0.51 pad 1.02)
  Top 0.203: R12.1 69.17,15.46 69.17,17.89 R11.2
  Top 0.406: R11.2 69.17,19.11 v69.37,19.31 | R8.1 69.67,27.01 v68.67,28.01
  Bottom 0.406: v69.37,19.31 69.37,27.31 v68.67,28.01
N$11  (via drill 0.51)
  Top 0.203: v38.89,21.35 38.48,21.75 36.66,21.75 35.64,20.74 R7.1 | v39.91,23.38 37.67,23.38 35.64,25.41 35.57,25.41
  Top 0.254: DISP1.21 33.87,27.12 35.57,25.41
  Bottom 0.203: v38.89,21.35 38.89,22.36 v39.91,23.38
N$15
  Top 0.406: MP1541.3 67.02,20.36 66.21,19.59 66.21,18.82 66.21,18.78 66.21,16.37 R12.2
N$17
  Top 0.406: R14.1 34.92,8.76 36.27,10.11 36.27,10.61 Q1.1
RESET  (via drill 0.51 pad 1.02)
  Top 0.203: DISP1.9 39.87,25.42 v40.17,25.11 | v50.07,22.21 50.07,22.11 MDL1.1 | v40.87,16.01 40.81,15.95 | Q2.3 35.23,16.47 40.41,16.47 v40.87,16.01 | R2.1 42.01,14.87 v40.87,16.01
  Bottom 0.203: 4.55,3.47 4.55,3.35 | v40.87,16.01 42.72,17.86 45.72,17.86 v50.07,22.21 47.17,25.11 v40.17,25.11 40.11,25.01 39.7,25.01 38.08,23.38 15.93,23.38 6.7,14.25 2.27,14.25 1.96,13.94 1.96,13.42 0.76,12.22 0.76,5.21 1.83,4.15 2.97,4.15 3.77,3.35
  Bottom 0.406: RESET.B 3.77,3.35 4.55,3.35 RESET.B'
RTS
  Top 0.203: U2.19 15.47,3.41 16.67,4.61 16.67,4.63 19.86,7.82 23.96,7.82 24.86,8.72 30.18,8.72 30.19,8.71 32.77,8.71 R14.2 32.92,8.66 34.17,9.91 34.17,11.91 35.82,13.56 Q2.2
RXD  (via drill 0.51 pad 1.02)
  Top 0.203: U2.21 15.17,4.41 16.97,6.21 v16.97,7.01 | MDL1.15 64.57,18.21 60.27,18.21 v53.17,11.11
  Bottom 0.203: v16.97,7.01 22.47,7.01 23.57,5.91 23.57,5.41 24.07,4.91 24.97,4.91 26.77,6.71 27.87,6.71 28.97,5.61 28.97,5.01 30.17,3.81 47.57,3.81 50.07,6.81 51.27,6.81 51.27,9.21 v53.17,11.11
SCL  (via drill 0.51, 0.51 pad 1.02, 0.51 pad 1.05)
  Top 0.203: DISP1.13 37.87,26.92 v38.67,26.11 | v62.77,17.09 63.68,16.17 64.5,16.17 MDL1.14 | CN1.2 3.92,13.53 v3.9,15.09
  Bottom 0.203: TEMP1.P$4 2.77,25.3 2.77,21.61 2.37,21.21 2.37,20.01 4.37,20.01 | 4.37,20.01 8.87,23.91 8.87,24.51 37.07,24.51 v38.67,26.11 57.51,26.11 61.98,21.55 62.77,20.73 62.77,20.13 v62.77,17.09 | v3.9,15.09 3.87,20.02 4.37,20.01
SDA  (via drill 0.51, 0.51 pad 1.02, 0.51 pad 1.05)
  Top 0.203: v66.53,13.83 65.92,14.44 64.9,14.44 MDL1.13 | 8.67,23.11 6.81,24.68 5.97,25.61 v3.87,25.61 | v17.37,25.71 14.77,23.11 8.67,23.11 | 8.67,23.11 7.47,21.91 v7.47,20.31 | CN1.3 4.42,13.66 v5.97,15.21
  Top 0.254: DISP1.14 DISP1.15 v36.87,26.52 v36.87,26.51
  Bottom 0.203: TEMP1.P$3 2.83,26.01 3.47,26.01 v3.87,25.61 | v66.53,13.83 66.53,17.5 57.42,26.91 39.02,26.91 39.01,26.93 38.33,26.93 37.92,26.51 v36.87,26.51 35.87,26.51 33.57,28.81 23.77,28.81 20.67,25.71 v17.37,25.71 | v5.97,15.21 5.97,18.81 v7.47,20.31
SDO  (via drill 0.51 pad 1.02)
  Top 0.203: v3.37,20.91 3.14,20.69 R9.1
  Bottom 0.203: TEMP1.P$5 4.87,25.33 4.87,21.21 3.57,21.21 v3.37,20.91
TXD  (via drill 0.51 pad 1.02)
  Top 0.203: U2.20 15.27,3.91 19.57,8.21 19.68,8.21 19.69,8.23 23.79,8.23 24.69,9.13 31.58,9.13 v32.77,10.31 | v59.87,20.71 64.68,20.61 MDL1.16
  Bottom 0.203: v32.77,10.31 50.85,10.31 53.06,12.52 52.97,13.51 59.87,20.61 v59.87,20.71
VIN  (via drill 0.51 pad 1.02)
  Top 0.203: U2.8 10.62,5.86 v9.67,6.81 | v20.57,5.31 19.37,5.31 19.17,5.11
  Top 0.305: U2.7 U2.8
  Top 0.406: C8.1 16.77,3.11 16.77,3.71 17.17,4.11 C7.1 19.17,4.16 19.17,5.11 19.17,6.41 20.07,7.31 22.77,7.31 23.52,6.56 X1.1 23.52,6.66 25.07,8.21 29.97,8.21 36.47,1.71 60.75,1.71 D1.A
  Bottom 0.203: v9.67,6.81 9.67,3.31 12.67,0.61 15.87,0.61 v20.57,5.31
VIN_PROT
  Top 0.406: D1.C 66.09,1.84 C1.1 66.12,5.06 66.37,5.31 C4.2 | U1.1 67.3,5.39 C4.2 | FB1.1 69.82,23.98 MP1541.5 MP1541.4 70.37,19.81 70.37,4.71 69.87,4.21 69.31,4.21 R6.2 67.86,5.31 C4.2

### Text on the board
bPlace: Ant | Rev 1.13 | Env Sensor GW | GDTech